# Altium schematic sheet CRSC0001.SchDoc
size A4
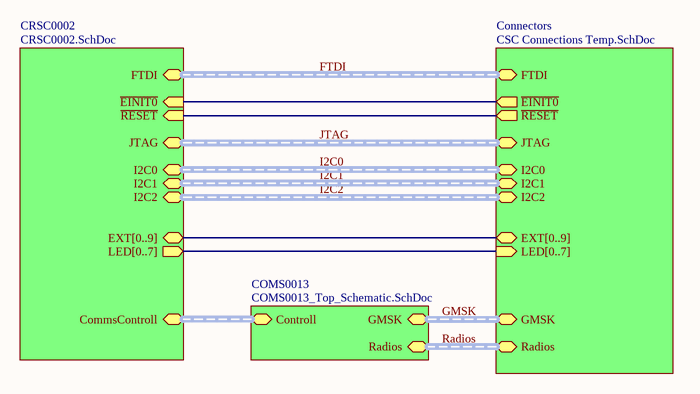
[diagram p0: CRSC0001.SchDoc]

## Sub-sheets
COMS0013 = COMS0013_Top_Schematic.SchDoc: GMSK (harness GMSK), Radios (harness Radios), Controll (harness CommsControll)
Connectors = CSC Connections Temp.SchDoc: JTAG (harness JTAG), FTDI (harness FTDI), I2C0 (harness I2C), I2C1 (harness I2C), I2C2 (harness I2C), GMSK (harness GMSK), Radios (harness Radios), EXT[0..9] (bidir), LED[0..7] (in), ~{EINIT0} (out), ~{RESET} (out)
CRSC0002 = CRSC0002.SchDoc: ~{EINIT0} (in), ~{RESET} (in), I2C1 (harness I2C), I2C0 (harness I2C), I2C2 (harness I2C), JTAG (harness JTAG), CommsControll (harness CommsControll), FTDI (harness FTDI), EXT[0..9] (bidir), LED[0..7] (out)

## Nets
(unnamed): sheet CRSC0002/~{EINIT0}, sheet Connectors/~{EINIT0}
(unnamed): sheet CRSC0002/~{RESET}, sheet Connectors/~{RESET}

## Buses and harness runs
bus sheet Connectors/EXT[0..9] = sheet CRSC0002/EXT[0..9]
bus sheet Connectors/LED[0..7] = sheet CRSC0002/LED[0..7]
harness FTDI = sheet Connectors/FTDI = sheet CRSC0002/FTDI
harness GMSK = sheet COMS0013/GMSK = sheet Connectors/GMSK
harness I2C0 = sheet Connectors/I2C0 = sheet CRSC0002/I2C0
harness I2C1 = sheet Connectors/I2C1 = sheet CRSC0002/I2C1
harness I2C2 = sheet Connectors/I2C2 = sheet CRSC0002/I2C2
harness JTAG = sheet Connectors/JTAG = sheet CRSC0002/JTAG
harness Radios = sheet COMS0013/Radios = sheet Connectors/Radios
harness sheet COMS0013/Controll = sheet CRSC0002/CommsControll